# EAGLE design 3rd_layer (EAGLE 9.6.2)
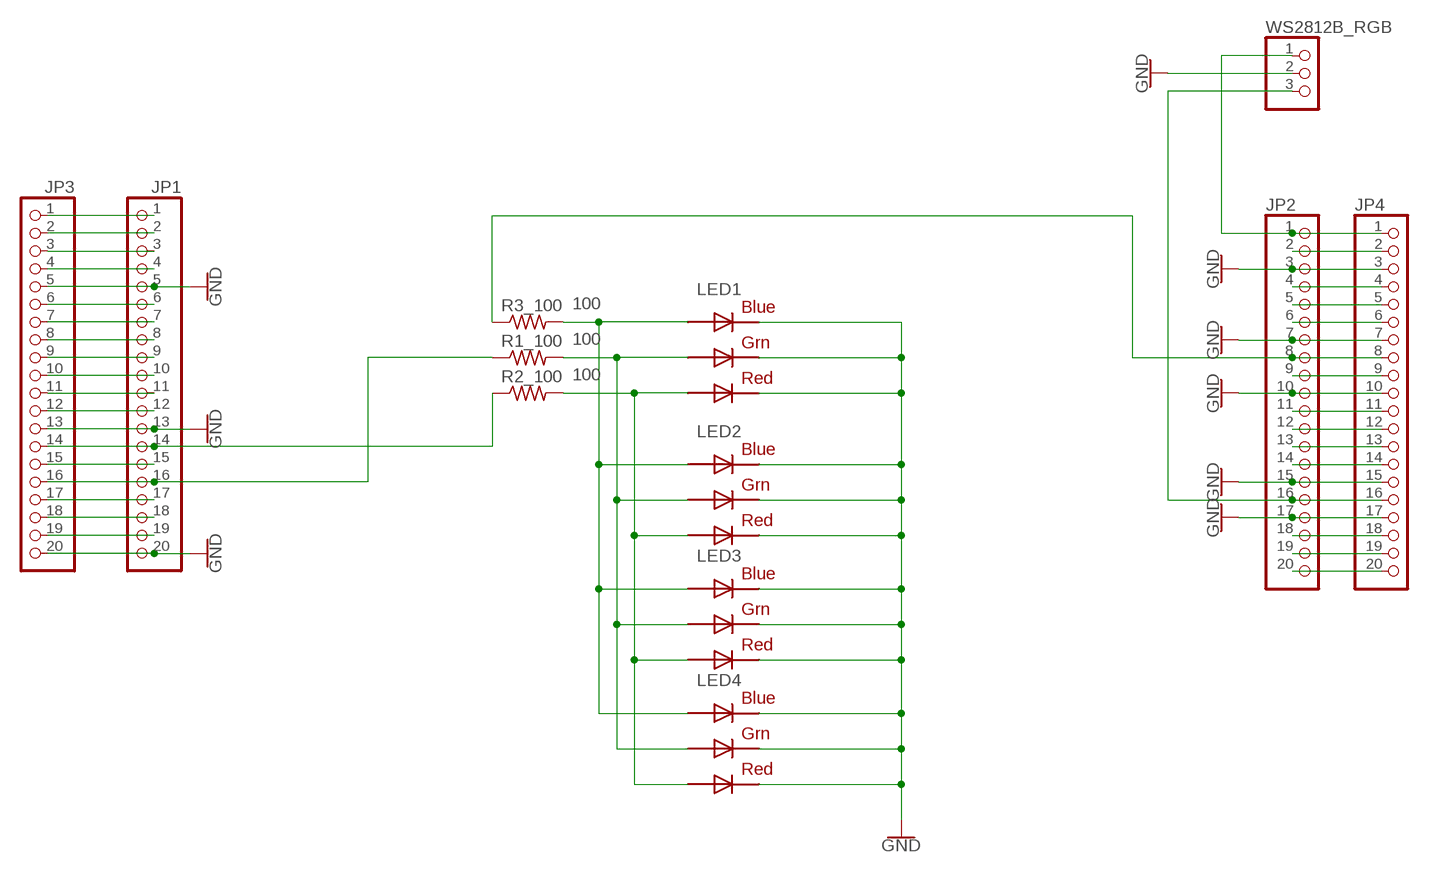
[diagram p0: schematic, sheet 1]

## Parts
JP1  PINHD-1X20  [1X20]
JP2  PINHD-1X20  [1X20]
JP3  PINHD-1X20  [1X20]
JP4  PINHD-1X20  [1X20]
LED1  RGBLED5050  [RGBLED5050]
LED2  RGBLED5050  [RGBLED5050]
LED3  RGBLED5050  [RGBLED5050]
LED4  RGBLED5050  [RGBLED5050]
R1_100  100  R-US_R0603  [R0603]
R2_100  100  R-US_R0603  [R0603]
R3_100  100  R-US_R0603  [R0603]
WS2812B_RGB  PINHD-1X3/90  [1X03/90]

## Nets
GND: JP1.5 JP1.13 JP1.20 JP2.3 JP2.7 JP2.10 JP2.15 JP2.17 JP3.5 JP3.13 JP3.20 JP4.3 JP4.7 JP4.10 JP4.15 JP4.17 LED1.4(BLUE_C) LED1.5(RED_C) LED1.6(GREEN_C) LED2.4(BLUE_C) LED2.5(RED_C) LED2.6(GREEN_C) LED3.4(BLUE_C) LED3.5(RED_C) LED3.6(GREEN_C) LED4.4(BLUE_C) LED4.5(RED_C) LED4.6(GREEN_C) WS2812B_RGB.2
N$2: JP2.8 JP4.8 R3_100.1
N$3: JP1.10 JP3.10
N$4: JP1.14 JP3.14 R2_100.1
N$5: JP1.9 JP3.9
N$6: JP1.3 JP3.3
N$7: JP1.1 JP3.1
N$8: JP1.2 JP3.2
N$9: JP1.4 JP3.4
N$10: JP1.6 JP3.6
N$11: JP1.7 JP3.7
N$12: JP1.8 JP3.8
N$13: JP1.12 JP3.12
N$15: JP1.15 JP3.15
N$16: JP1.16 JP3.16 R1_100.1
N$17: JP1.18 JP3.18
N$18: JP1.19 JP3.19
N$19: JP2.1 JP4.1 WS2812B_RGB.1
N$20: JP2.2 JP4.2
N$21: JP2.4 JP4.4
N$22: JP2.5 JP4.5
N$23: JP2.6 JP4.6
N$24: JP2.9 JP4.9
N$25: JP2.12 JP4.12
N$26: JP2.13 JP4.13
N$27: JP2.14 JP4.14
N$28: JP2.16 JP4.16 WS2812B_RGB.3
N$29: LED1.3(BLUE_A) LED2.3(BLUE_A) LED3.3(BLUE_A) LED4.3(BLUE_A) R3_100.2
N$30: LED1.1(GREEN_A) LED2.1(GREEN_A) LED3.1(GREEN_A) LED4.1(GREEN_A) R1_100.2
N$31: LED1.2(RED_A) LED2.2(RED_A) LED3.2(RED_A) LED4.2(RED_A) R2_100.2
N$32: JP2.18 JP4.18
N$33: JP2.19 JP4.19
N$34: JP2.20 JP4.20
N$35: JP1.17 JP3.17
N$36: JP1.11 JP3.11
N$37: JP2.11 JP4.11

## Library data of the parts
JP1-JP4 = pinhead:PINHD-1X20: PIN HEADER
LED1-LED4 = adafruit:RGBLED: For 5050 RGB LEDs, the order of the LEDs may vary from one manufacturer to another!
R1_100 R2_100 R3_100 = adafruit:R-US_: RESISTOR, American symbol
WS2812B_RGB = pinhead:PINHD-1X3: PIN HEADER

## Board
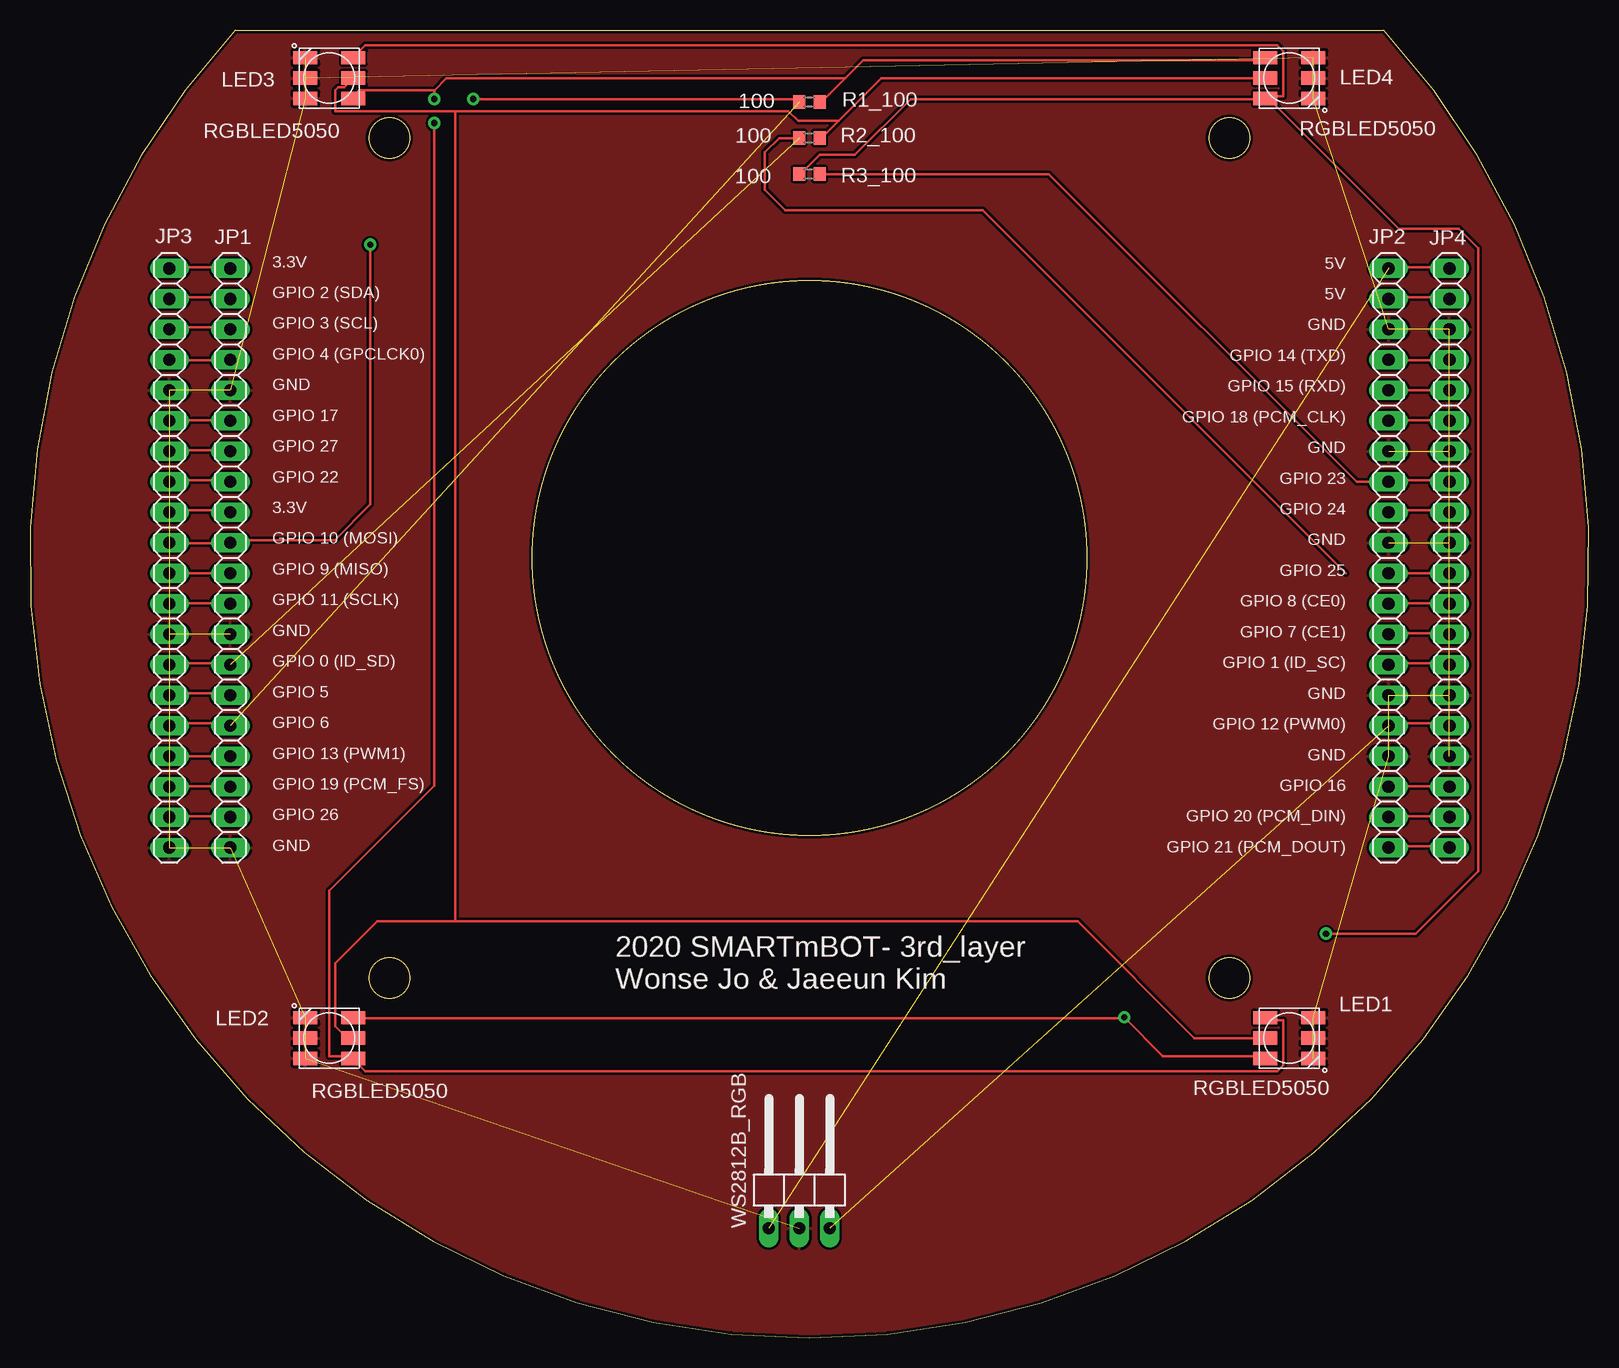
[diagram p1: board, top side]
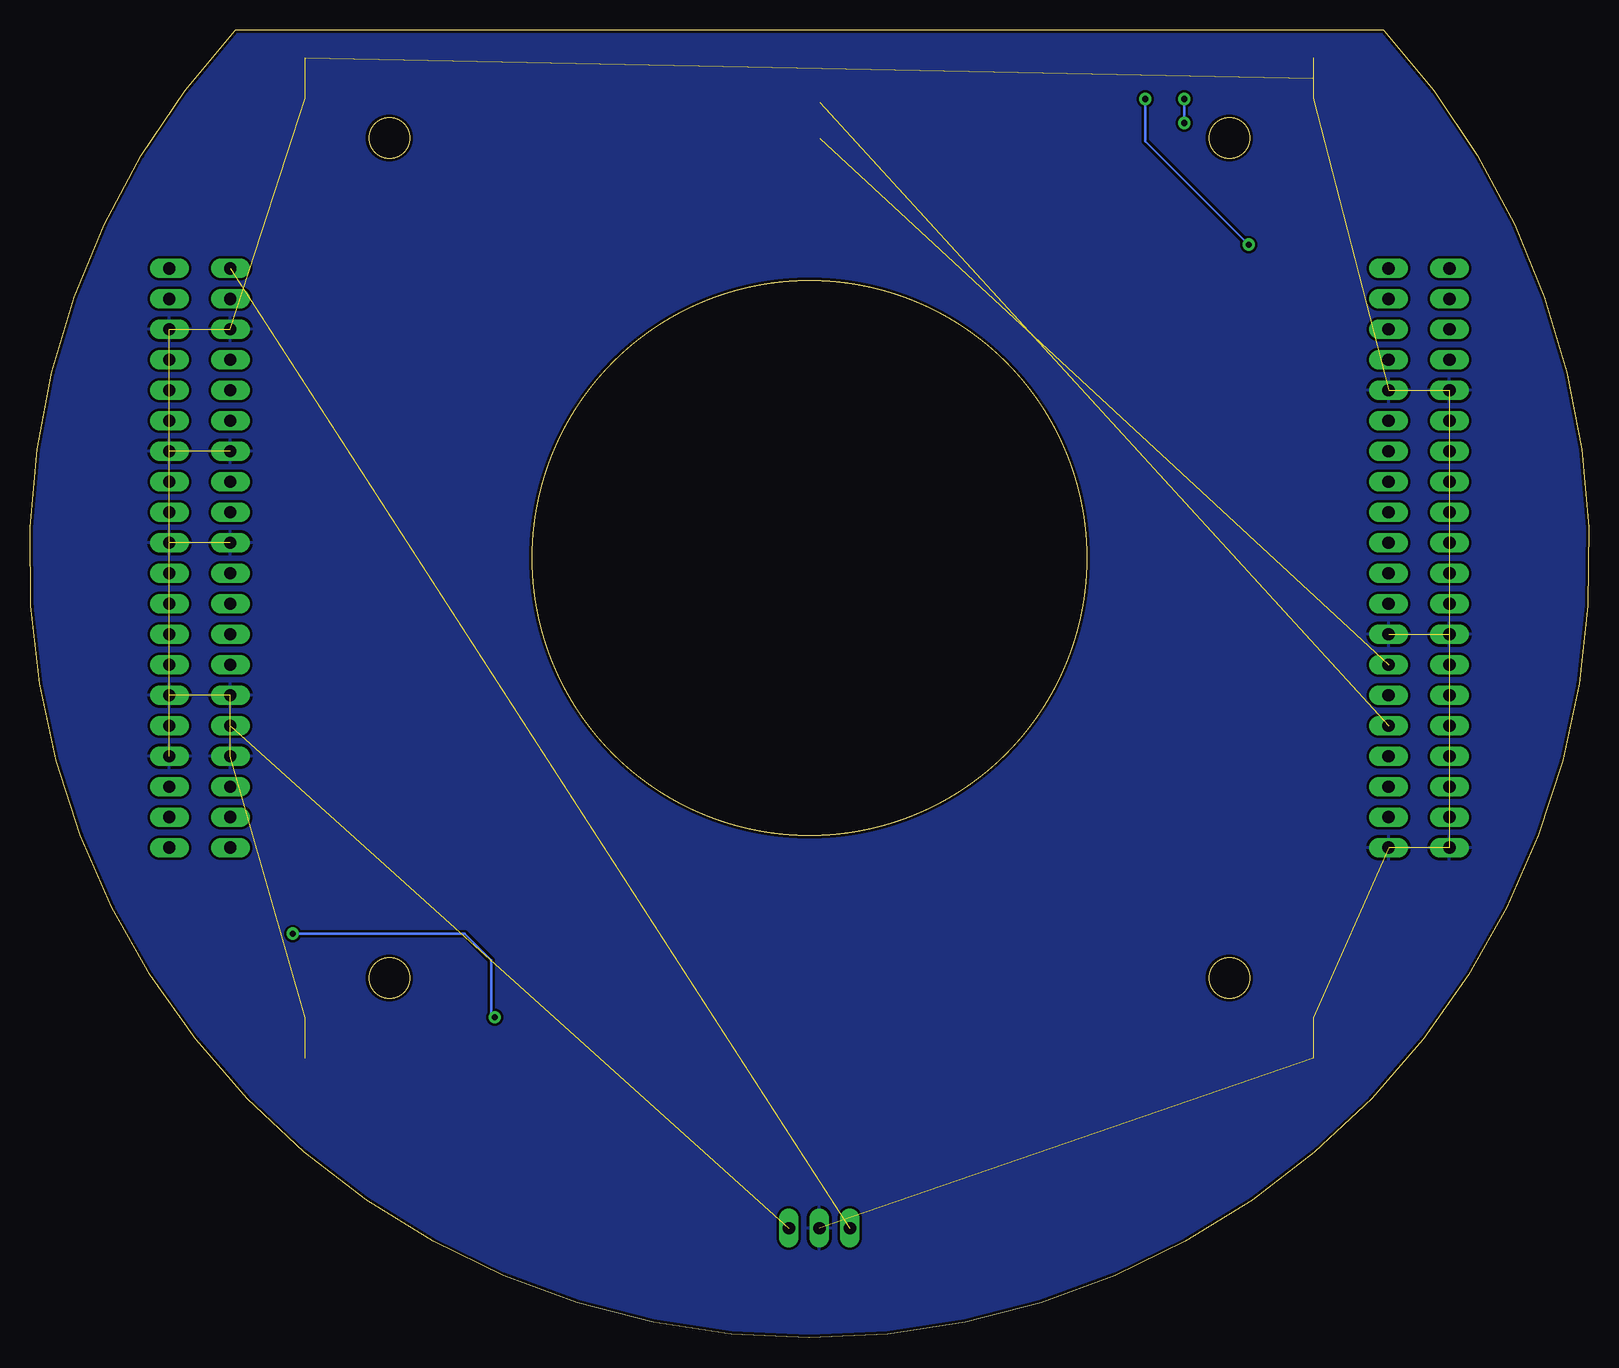
[diagram p2: board, bottom side, seen from below]

Size 129.9 x 109 mm. Coordinates in mm from the lower left corner, seen from the top.
Outline: 17.11,109 112.79,109 arc-265 17.11,109
Outline: circle at 29.95,100 radius 1.7
Outline: circle at 99.95,30 radius 1.7
Outline: circle at 29.95,30 radius 1.7
Outline: circle at 99.95,100 radius 1.7
Outline: circle at 64.95,65 radius 23.1
Copper layers (1*16): Top 0.035mm / dielectric 1.5mm / Bottom 0.035mm
Design rules "SparkFun": minimum track width 8mil, minimum drill 20mil, track to track 8mil, track to pad 8mil, pad to pad 8mil, via to via 8mil, smd to smd 8mil, copper to edge 10mil, drill to drill 8mil, minimum pad ring 12mil, minimum via ring 10mil, stop-mask expansion 4mil, vias tented up to drill 25mil, thermal gap 10mil

### Footprints (pad centres in the part's own frame; a part is rotated, then mirrored left to right if it is on the bottom)
1X20 = drill 1.016 long: 1 -24.13,0; 2 -21.59,0; 3 -19.05,0; 4 -16.51,0; 5 -13.97,0; 6 -11.43,0; 7 -8.89,0; 8 -6.35,0; 9 -3.81,0; 10 -1.27,0; 11 1.27,0; 12 3.81,0; 13 6.35,0; 14 8.89,0; 15 11.43,0; 16 13.97,0; 17 16.51,0; 18 19.05,0; 19 21.59,0; 20 24.13,0
RGBLED5050 = smd 2 x 1.1: 1 -2,1.7; 2 -2,0; 3 -2,-1.7; 4 2,-1.7; 5 2,0; 6 2,1.7
R0603 = smd 1 x 1.1: 1 -0.85,0; 2 0.85,0
1X03/90 = drill 1.016 long: 1 -2.54,-3.81; 2 0,-3.81; 3 2.54,-3.81

### Placement (x,y rotation side)
JP1  16.69,65 270 top
JP2  113.21,65 270 top
JP3  11.61,65 270 top
JP4  118.29,65 270 top
LED1  104.95,25 0 top
LED2  24.95,25 180 top
LED3  24.95,105 180 top
LED4  104.95,105 0 top
R1_100  64.95,103 0 top
R2_100  64.95,100 0 top
R3_100  64.95,97 180 top
WS2812B_RGB  64.11,12.96 0 top

### Tracks (layer width: path | path; a pad name or v marks a point on that pad's centre or on a via)
GND  (28 unrouted)
  pour Top: 17.11,109 112.79,109 arc-265
  pour Bottom: 17.11,109 112.79,109 arc-265
N$2
  Top 0.203: R3_100.1 84.89,97 110.54,71.35 JP2.8 113.45,71.5 118.2,71.5 JP4.8
N$3  (via drill 0.51)
  Top 0.203: 63.95,103 63.7,103.25 v36.95,103.25 | v28.34,91.12 28.34,69.46 25.38,66.5 16.7,66.5 JP1.10 16.45,66.25 11.7,66.25 JP3.10
  Bottom 0.203: v28.34,91.12 36.95,99.72 v36.95,103.25
N$4  (1 unrouted)
  Top 0.203: 109.65,63.73 79.4,93.98 62.93,93.98 61.23,95.68 61.23,98.8 62.43,100 R2_100.1 | JP3.14 11.7,56.25 16.45,56.25 JP1.14
N$5
  Top 0.203: JP3.9 11.7,69 16.45,69 JP1.9
N$6
  Top 0.203: JP3.3 11.7,84.25 16.45,84.25 JP1.3
N$7
  Top 0.203: JP3.1 11.7,89.25 16.45,89.25 JP1.1
N$8
  Top 0.203: JP3.2 11.7,86.75 16.45,86.75 JP1.2
N$9
  Top 0.203: JP3.4 11.7,81.5 16.45,81.5 JP1.4
N$10
  Top 0.203: JP3.6 11.7,76.5 16.45,76.5 JP1.6
N$11
  Top 0.203: JP3.7 11.7,74 16.45,74 JP1.7
N$12
  Top 0.203: JP3.8 11.7,71.5 16.45,71.5 JP1.8
N$13
  Top 0.203: JP3.12 11.7,61.25 16.45,61.25 JP1.12
N$15
  Top 0.203: JP3.15 11.7,53.75 16.45,53.75 JP1.15
N$16  (1 unrouted)
  Top 0.203: JP3.16 11.7,51.25 16.45,51.25 JP1.16
N$17
  Top 0.203: JP3.18 11.7,46 16.45,46 JP1.18
N$18
  Top 0.203: JP3.19 11.7,43.5 16.45,43.5 JP1.19
N$19  (1 unrouted)
  Top 0.203: JP2.1 113.45,89.25 118.2,89.25 JP4.1
N$20
  Top 0.203: JP2.2 113.45,86.75 118.2,86.75 JP4.2
N$21
  Top 0.203: JP2.4 113.45,81.5 118.2,81.5 JP4.4
N$22
  Top 0.203: JP2.5 113.45,79 118.2,79 JP4.5
N$23
  Top 0.203: JP2.6 113.45,76.5 118.2,76.5 JP4.6
N$24
  Top 0.203: JP2.9 113.45,69 118.2,69 JP4.9
N$25
  Top 0.203: JP2.12 113.45,61.25 118.2,61.25 JP4.12
N$26
  Top 0.203: JP2.13 113.45,58.75 118.2,58.75 JP4.13
N$27
  Top 0.203: JP2.14 113.45,56.25 118.2,56.25 JP4.14
N$28  (1 unrouted)
  Top 0.203: JP2.16 113.45,51.25 118.2,51.25 JP4.16
N$29  (via drill 0.51)
  Top 0.203: LED2.3 26.95,26.64 91.1,26.64 v91.18,26.72 94.4,23.5 102.95,23.5 LED1.3 | R3_100.2 64.2,97 65.81,98.61 68.74,98.61 73.38,103.25 102.95,103.25 LED4.3 102.95,103.5 103,103.5 | 103,103.5 104.45,103.5 104.45,107.25 103.95,107.75 27.95,107.75 26.95,106.75 LED3.3 | v108,33.7 v108.01,33.7 115.46,33.7 120.68,38.91 120.68,90.82 119.07,92.43 114.07,92.43 103,103.5
  Bottom 0.203: v108,33.7 93.67,33.7 91.46,31.49 91.46,27 v91.18,26.72
N$30  (via drill 0.51)
  Top 0.203: 67.92,104.97 69.45,106.5 102.95,106.5 LED4.1 | 67.92,104.97 65.95,103 R1_100.2 | 33.7,104 33.71,104 34.69,104.97 67.92,104.97 | 33.7,104 27.45,104 26.95,103.5 LED3.1 | LED1.1 102.95,26.5 104.45,26.5 104.45,22.75 103.95,22.25 27.95,22.25 26.95,23.25 LED2.1 26.95,23.5 24.95,23.5 24.95,37.27 33.7,46.02 v33.7,101.25 | v33.7,103.25 33.7,104
  Bottom 0.203: v33.7,101.25 v33.7,103.25
N$31
  Top 0.203: LED2.2 26.45,25 25.45,26 25.45,31.23 28.95,34.72 35.43,34.72 | 35.43,34.72 87.3,34.72 97.03,25 LED1.2 | 67.38,101.42 70.95,105 LED4.2 | 67.38,101.42 65.95,100 R2_100.2 | LED3.2 26.2,104.25 25.7,104.25 25.45,104 25.45,102.25 35.43,102.25 | 35.43,102.25 63.2,102.25 64.03,101.42 67.38,101.42 | 35.43,102.25 35.43,34.72
N$32
  Top 0.203: JP2.18 113.45,46 118.2,46 JP4.18
N$33
  Top 0.203: JP2.19 113.45,43.5 118.2,43.5 JP4.19
N$34
  Top 0.203: JP2.20 113.45,41 118.2,41 JP4.20
N$35
  Top 0.203: JP3.17 11.7,48.5 16.45,48.5 JP1.17
N$36
  Top 0.203: JP3.11 11.7,63.75 16.45,63.75 JP1.11
N$37
  Top 0.203: JP4.11 118.2,63.75 113.45,63.75 JP2.11

### Text on the board
tPlace: 3.3V / GPIO 2 (SDA) / GPIO 3 (SCL) / GPIO 4 (GPCLCK0) / GND / GPIO 17 / GPIO 27 / GPIO 22 / 3.3V / GPIO 10 (MOSI) / GPIO 9 (MISO) / GPIO 11 (SCLK) / GND / GPIO 0 (ID_SD) / GPIO 5 / GPIO 6 / GPIO 13 (PWM1) / GPIO 19 (PCM_FS) / GPIO 26 / GND | 5V / 5V / GND / GPIO 14 (TXD) / GPIO 15 (RXD) / GPIO 18 (PCM_CLK) / GND / GPIO 23 / GPIO 24 / GND / GPIO 25 / GPIO 8 (CE0) / GPIO 7 (CE1) / GPIO 1 (ID_SC) / GND / GPIO 12 (PWM0) / GND / GPIO 16 / GPIO 20 (PCM_DIN) / GPIO 21 (PCM_DOUT) | 2020 SMARTmBOT- 3rd_layer / Wonse Jo & Jaeeun Kim